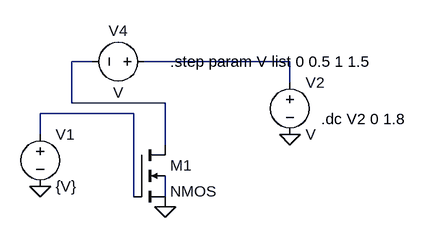
[diagram p0: schematic varying input in step.asc]
varying input in step.asc, the LTspice schematic file:
Version 4
SHEET 1 880 680
WIRE 64 32 32 32
WIRE 368 32 144 32
WIRE 368 64 368 32
WIRE 32 96 32 32
WIRE 176 96 32 96
WIRE 128 112 -16 112
WIRE -16 144 -16 112
WIRE 176 160 176 96
WIRE 128 240 128 112
WIRE 176 240 176 208
FLAG 368 144 0
FLAG 176 256 0
FLAG -16 224 0
SYMBOL voltage -16 128 R0
SYMATTR InstName V1
SYMATTR Value {V}
SYMBOL voltage 368 48 R0
SYMATTR InstName V2
SYMBOL voltage 160 32 R90
WINDOW 0 -32 56 VBottom 2
WINDOW 3 32 56 VTop 2
SYMATTR InstName V4
SYMBOL nmos4 128 160 R0
SYMATTR InstName M1
TEXT 184 32 Left 2 !.step param V list 0 0.5 1 1.5
TEXT 416 120 Left 2 !.dc V2 0 1.8

The netlist it stands for:
* varying input in step.asc
V1 N003 0 {V}
V2 N002 0 V
V4 N002 N001 V
M1 N001 N003 0 N004 NMOS
.model NMOS NMOS
.model PMOS PMOS
.lib standard.mos
.step param V list 0 0.5 1 1.5
.dc V2 0 1.8
.backanno
.end